# EAGLE schematic SGWB circuit test board rev1 (EAGLE 9.5.0)
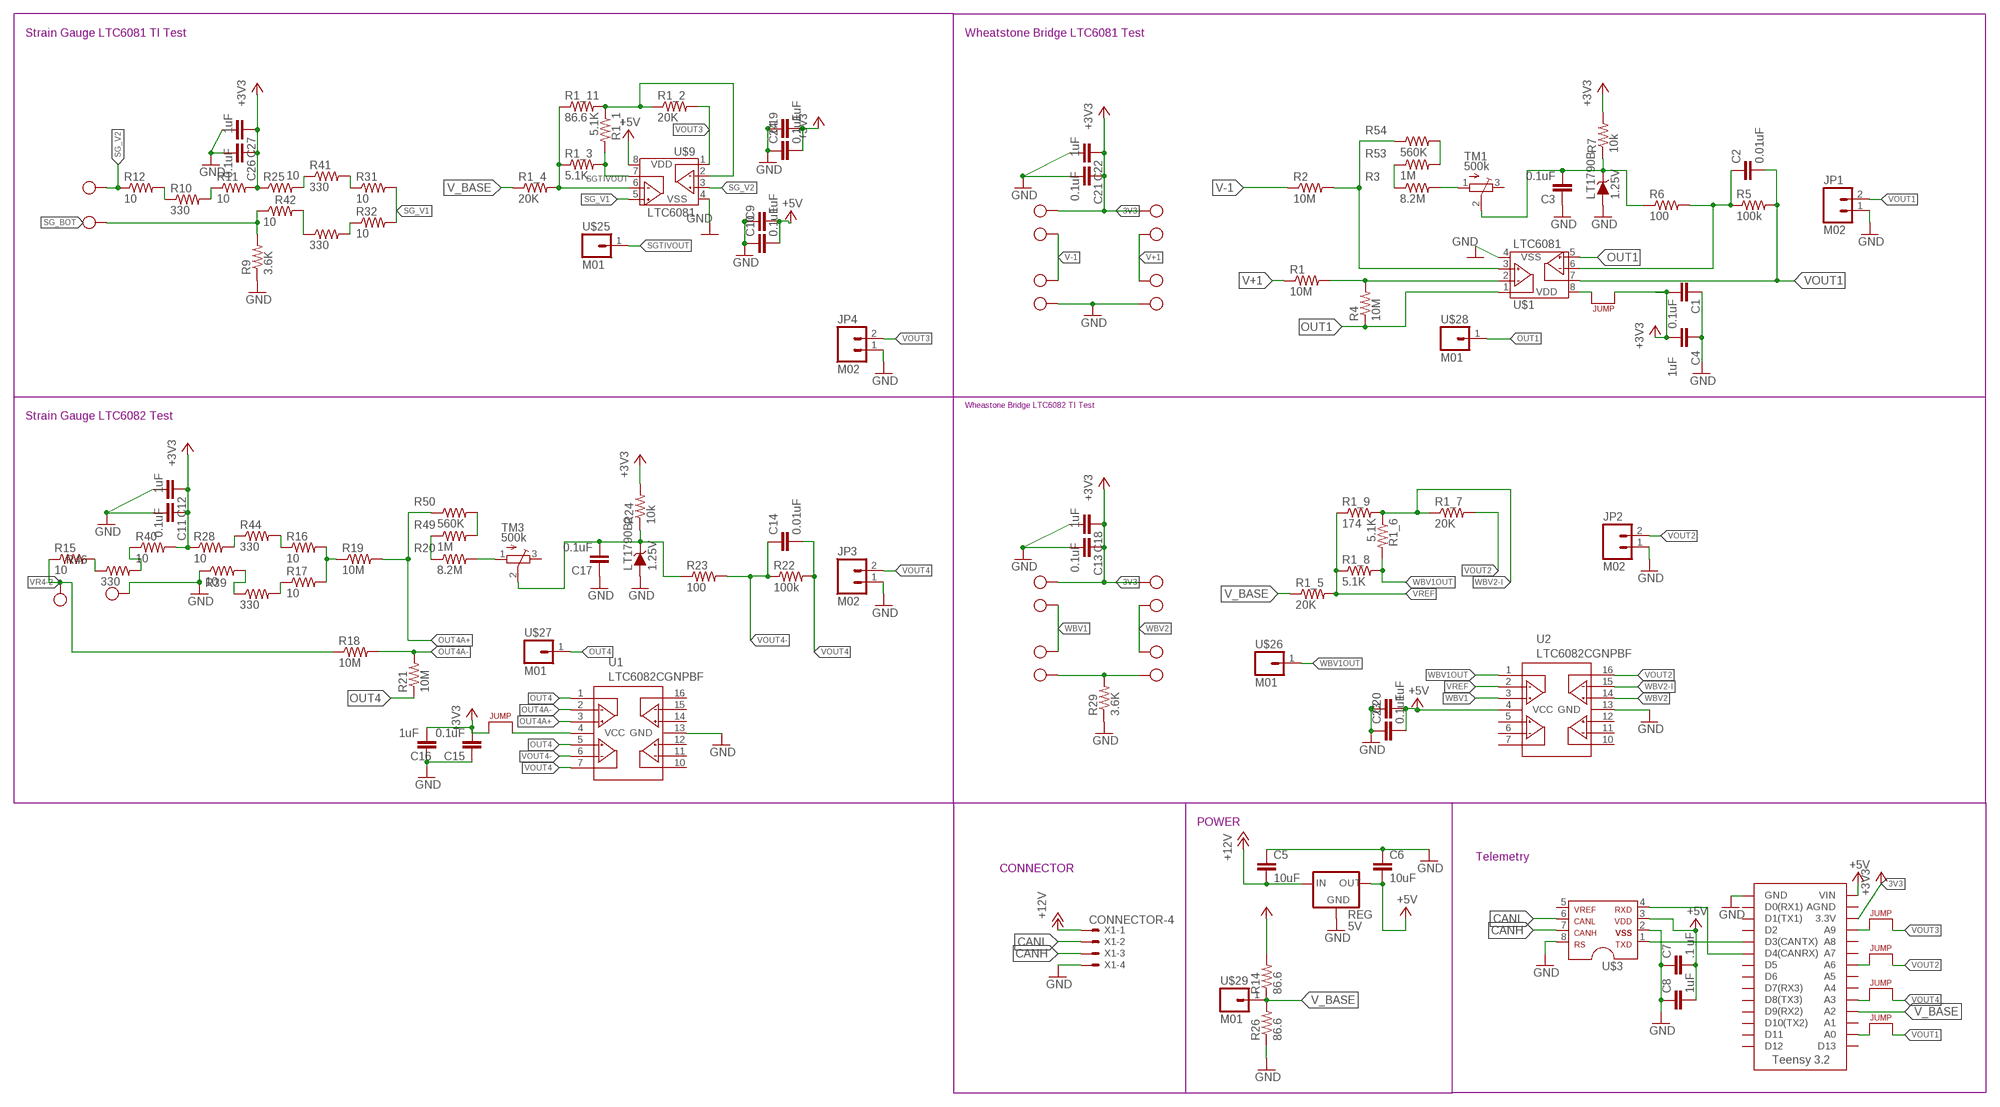
[diagram p0: schematic, sheet 1]

## Parts
C1  0.1uF  CAP0805  [0805]
C2  0.01uF  CAPPTH  [CAP-PTH-SMALL]
C3  0.1uF  CAPPTH  [CAP-PTH-SMALL]
C4  1uF  CAPPTH  [CAP-PTH-SMALL]
C5  10uF  CAPPTH  [CAP-PTH-SMALL]
C6  10uF  CAPPTH  [CAP-PTH-SMALL]
C7  .1 uF  CAP0805  [0805]
C8  1uF  CAP0805  [0805]
C9  1uF  CAP0805  [0805]
C10  0.1uF  CAPPTH  [CAP-PTH-SMALL]
C11  0.1uF  CAPPTH  [CAP-PTH-SMALL]
C12  1uF  CAP0805  [0805]
C13  0.1uF  CAPPTH  [CAP-PTH-SMALL]
C14  0.01uF  CAPPTH  [CAP-PTH-SMALL]
C15  0.1uF  CAPPTH  [CAP-PTH-SMALL]
C16  1uF  CAP0805  [0805]
C17  0.1uF  CAPPTH  [CAP-PTH-SMALL]
C18  1uF  CAP0805  [0805]
C19  1uF  CAP0805  [0805]
C20  1uF  CAP0805  [0805]
C21  0.1uF  CAPPTH  [CAP-PTH-SMALL]
C22  1uF  CAP0805  [0805]
C23  0.1uF  CAPPTH  [CAP-PTH-SMALL]
C24  0.1uF  CAPPTH  [CAP-PTH-SMALL]
C26  0.1uF  CAPPTH  [CAP-PTH-SMALL]
C27  1uF  CAP0805  [0805]
J1  JUMPER.1  [1X02]
J2  JUMPER.1  [1X02]
J3  JUMPER.1  [1X02]
J4  JUMPER.1  [1X02]
J5  JUMPER.1  [1X02]
J6  JUMPER.1  [1X02]
JP1  M02  [1X02]
JP2  M02  [1X02]
JP3  M02  [1X02]
JP4  M02  [1X02]
LT1790B  1.25V  DIODE_ZENER0805  [0805_D]
LT1790B2  1.25V  DIODE_ZENER0805  [0805_D]
R1  10M  RESISTORAXIAL-0.3  [AXIAL-0.3]
R1_1  5.1K  RESISTORAXIAL-0.3  [AXIAL-0.3]
R1_2  20K  RESISTORAXIAL-0.3  [AXIAL-0.3]
R1_3  5.1K  RESISTORAXIAL-0.3  [AXIAL-0.3]
R1_4  20K  RESISTORAXIAL-0.3  [AXIAL-0.3]
R1_5  20K  RESISTORAXIAL-0.3  [AXIAL-0.3]
R1_6  5.1K  RESISTORAXIAL-0.3  [AXIAL-0.3]
R1_7  20K  RESISTORAXIAL-0.3  [AXIAL-0.3]
R1_8  5.1K  RESISTORAXIAL-0.3  [AXIAL-0.3]
R1_9  174  RESISTORAXIAL-0.3  [AXIAL-0.3]
R1_11  86.6  RESISTORAXIAL-0.3  [AXIAL-0.3]
R2  10M  RESISTORAXIAL-0.3  [AXIAL-0.3]
R3  8.2M  RESISTORAXIAL-0.3  [AXIAL-0.3]
R4  10M  RESISTORAXIAL-0.3  [AXIAL-0.3]
R5  100k  RESISTORAXIAL-0.3  [AXIAL-0.3]
R6  100  RESISTORAXIAL-0.3  [AXIAL-0.3]
R7  10k  RESISTORAXIAL-0.3  [AXIAL-0.3]
R9  3.6K  RESISTORAXIAL-0.3  [AXIAL-0.3]
R10  330  RESISTORAXIAL-0.3  [AXIAL-0.3]
R11  10  RESISTORAXIAL-0.3  [AXIAL-0.3]
R12  10  RESISTORAXIAL-0.3  [AXIAL-0.3]
R14  86.6  RESISTORAXIAL-0.3  [AXIAL-0.3]
R15  10  RESISTORAXIAL-0.3  [AXIAL-0.3]
R16  10  RESISTORAXIAL-0.3  [AXIAL-0.3]
R17  10  RESISTORAXIAL-0.3  [AXIAL-0.3]
R18  10M  RESISTORAXIAL-0.3  [AXIAL-0.3]
R19  10M  RESISTORAXIAL-0.3  [AXIAL-0.3]
R20  8.2M  RESISTORAXIAL-0.3  [AXIAL-0.3]
R21  10M  RESISTORAXIAL-0.3  [AXIAL-0.3]
R22  100k  RESISTORAXIAL-0.3  [AXIAL-0.3]
R23  100  RESISTORAXIAL-0.3  [AXIAL-0.3]
R24  10k  RESISTORAXIAL-0.3  [AXIAL-0.3]
R25  10  RESISTORAXIAL-0.3  [AXIAL-0.3]
R26  86.6  RESISTORAXIAL-0.3  [AXIAL-0.3]
R27  330  RESISTORAXIAL-0.3  [AXIAL-0.3]
R28  10  RESISTORAXIAL-0.3  [AXIAL-0.3]
R29  3.6K  RESISTORAXIAL-0.3  [AXIAL-0.3]
R31  10  RESISTORAXIAL-0.3  [AXIAL-0.3]
R32  10  RESISTORAXIAL-0.3  [AXIAL-0.3]
R39  330  RESISTORAXIAL-0.3  [AXIAL-0.3]
R40  10  RESISTORAXIAL-0.3  [AXIAL-0.3]
R41  330  RESISTORAXIAL-0.3  [AXIAL-0.3]
R42  10  RESISTORAXIAL-0.3  [AXIAL-0.3]
R44  330  RESISTORAXIAL-0.3  [AXIAL-0.3]
R45  10  RESISTORAXIAL-0.3  [AXIAL-0.3]
R46  330  RESISTORAXIAL-0.3  [AXIAL-0.3]
R49  1M  RESISTORAXIAL-0.3  [AXIAL-0.3]
R50  560K  RESISTORAXIAL-0.3  [AXIAL-0.3]
R53  1M  RESISTORAXIAL-0.3  [AXIAL-0.3]
R54  560K  RESISTORAXIAL-0.3  [AXIAL-0.3]
REG  5V  OKI-78SR-5  [OKI-78SR]
TM1  500k  TRIMPOT3386  [TRIM-3386]
TM3  500k  TRIMPOT3386  [TRIM-3386]
U1  LTC6082CGNPBF  [SSOP-16_GN]
U2  LTC6082CGNPBF  [SSOP-16_GN]
U$1  LTC6081  [MSOP-8_MS]
U$2  TEENSY_3.2_SIMPLE  [TEENSY_3.2_SIMPLE]
U$3  MCP2551DIL  [DIL08]
U$4  TEST_POINT  [TEST_POINT]
U$5  TEST_POINT  [TEST_POINT]
U$6  TEST_POINT  [TEST_POINT]
U$7  TEST_POINT  [TEST_POINT]
U$8  TEST_POINT  [TEST_POINT]
U$9  LTC6081  [MSOP-8_MS]
U$10  TEST_POINT  [TEST_POINT]
U$11  TEST_POINT  [TEST_POINT]
U$12  TEST_POINT  [TEST_POINT]
U$13  TEST_POINT  [TEST_POINT]
U$14  TEST_POINT  [TEST_POINT]
U$15  TEST_POINT  [TEST_POINT]
U$16  TEST_POINT  [TEST_POINT]
U$17  TEST_POINT  [TEST_POINT]
U$18  TEST_POINT  [TEST_POINT]
U$19  TEST_POINT  [TEST_POINT]
U$20  TEST_POINT  [TEST_POINT]
U$21  TEST_POINT  [TEST_POINT]
U$22  TEST_POINT  [TEST_POINT]
U$23  TEST_POINT  [TEST_POINT]
U$24  TEST_POINT  [TEST_POINT]
U$25  M01  [1X01]
U$26  M01  [1X01]
U$27  M01  [1X01]
U$28  M01  [1X01]
U$29  M01  [1X01]
X1  CONNECTOR-4  [MINIFIT_5566-4]

## Nets
3V3: C1.2 C4.1 C11.1 C12.1 C13.1 C15.2 C16.1 C18.1 C19.1 C21.1 C22.1 C24.2 C26.1 C27.1 J5.1 J6.1 R7.P$2 R11.P$2 R14.P$2 R24.P$2 R25.P$1 R28.P$1 R40.P$2 U$2.3.3V U$4.P$1 U$11.P$1 U$18.P$1 U$24.P$1 ; supply symbol labelled +3V3
+5V: C6.2 C7.2 C8.2 C9.1 C10.2 C20.1 C23.2 REG.3(OUT) U2.4(VCC) U$2.VIN U$3.3 U$9.8(VDD)
+12V: C5.2 REG.1(IN) X1.1
CANH: U$3.7 X1.3
CANL: U$3.6 X1.2
GND: C1.1 C3.1 C4.2 C5.1 C6.1 C7.1 C8.1 C9.2 C10.1 C11.2 C12.2 C13.2 C15.1 C16.2 C17.1 C18.2 C19.2 C20.2 C21.2 C22.2 C23.1 C24.1 C26.2 C27.2 JP1.1 JP2.1 JP3.1 JP4.1 LT1790B2.A LT1790B.A R9.P$1 R26.P$1 R29.P$1 R45.P$1 REG.2(GND) U1.13(GND) U2.13(GND) U$1.4(VSS) U$2.GND U$3.2 U$3.8 U$8.P$1 U$9.4(VSS) U$14.P$1 U$15.P$1 X1.4
INB-: C2.1 R5.P$1 R6.P$2 U$1.6(VINB-)
N$1: R1.P$2 R4.P$2 U$1.2(VINA-)
N$2: R2.P$2 R54.P$1 U$1.3(VINA+)
N$3: C3.2 LT1790B.C R6.P$1 R7.P$1 TM1.2(S)
N$4: J1.1 U$2.A0
N$5: R3.P$2 TM1.1(A)
N$6: U$2.D3(CANTX) U$3.1
N$7: J2.1 U$2.A3
N$8: J3.1 U$2.A6
N$9: U$2.D4(CANRX) U$3.4
N$10: R1_3.P$1 R1_4.P$2 R1_11.P$1 U$9.6(VINB-)
N$11: R10.P$1 R12.P$2
N$12: R10.P$2 R11.P$1
N$13: R16.P$2 R17.P$2 R19.P$1
N$14: J5.2 U1.4(VCC)
N$15: J6.2 U$1.8(VDD)
N$16: C17.2 LT1790B2.C R23.P$1 R24.P$1 TM3.2(S)
N$17: R20.P$2 TM3.1(A)
N$18: R1_1.P$1 R1_2.P$1 R1_11.P$2 U$9.2(VINA-)
N$19: R27.P$2 R32.P$1
N$20: R31.P$1 R41.P$2
N$21: R16.P$1 R44.P$2
N$22: J4.1 U$2.A9
N$23: R29.P$2 U$20.P$1 U$21.P$1
N$24: R17.P$1 R39.P$2
N$25: R25.P$2 R41.P$1
N$31: R27.P$1 R42.P$2
N$33: R28.P$2 R44.P$1
N$34: R39.P$1 R45.P$2
N$35: R15.P$2 R46.P$1
N$36: R40.P$1 R46.P$2
N$41: R20.P$1 R49.P$1
N$42: R49.P$2 R50.P$2
N$49: R3.P$1 R53.P$1
N$50: R53.P$2 R54.P$2
OUT1: R4.P$1 U$1.1(VOUTA) U$1.5(VINB+) U$28.1
OUT4: R21.P$1 U1.1(OUTA) U1.5(+INB) U$27.1
OUT4A+: R19.P$2 R50.P$1 U1.3(+INA)
OUT4A-: R18.P$2 R21.P$2 U1.2(-INA)
SG_BOT: R9.P$2 R42.P$1 U$6.P$1
SG_V1: R31.P$2 R32.P$2 U$9.5(VINB+)
SG_V2: R12.P$1 U$5.P$1 U$9.3(VINA+)
SGTIVOUT: R1_1.P$2 R1_3.P$2 U$9.7(VOUTB) U$25.1
V+1: R1.P$1 U$12.P$1 U$13.P$1
V-1: R2.P$1 U$16.P$1 U$17.P$1
V_BASE: R1_4.P$1 R1_5.P$1 R14.P$1 R26.P$2 U$2.A2 U$29.1
VOUT1: C2.2 J1.2 JP1.2 R5.P$2 U$1.7(VOUTB)
VOUT2: J3.2 JP2.2 R1_7.P$2 U2.16(OUTD)
VOUT3: J4.2 JP4.2 R1_2.P$2 U$9.1(VOUTA)
VOUT4: C14.2 J2.2 JP3.2 R22.P$2 U1.7(OUTB)
VOUT4-: C14.1 R22.P$1 R23.P$2 U1.6(-INB)
VR4-2: R15.P$1 R18.P$1 U$10.P$1
VREF: R1_5.P$2 R1_8.P$1 R1_9.P$1 U2.2(-INA)
WBV1: U2.3(+INA) U$22.P$1 U$23.P$1
WBV1OUT: R1_6.P$2 R1_8.P$2 U2.1(OUTA) U$26.1
WBV2: U2.14(+IND) U$7.P$1 U$19.P$1
WBV2-I: R1_6.P$1 R1_7.P$1 R1_9.P$2 U2.15(-IND)
Unconnected: TM1.3(E) TM3.3(E) U1.10(OUTC) U1.11(-INC) U1.12(+INC) U1.14(+IND) U1.15(-IND) U1.16(OUTD) U2.5(+INB) U2.6(-INB) U2.7(OUTB) U2.10(OUTC) U2.11(-INC) U2.12(+INC) U$2.A1 U$2.A4 U$2.A5 U$2.A7 U$2.A8 U$2.AGND U$2.D0(RX1) U$2.D1(TX1) U$2.D2 U$2.D5 U$2.D6 U$2.D7(RX3) U$2.D8(TX3) U$2.D9(RX2) U$2.D10(TX2) U$2.D11 U$2.D12 U$2.D13 U$3.5

## Notes on the sheet
- Strain Gauge LTC6081 TI Test | Wheatstone Bridge LTC6081 Test
- Wheastone Bridge LTC6082 TI Test
- Strain Gauge LTC6082 Test
- POWER
- Telemetry
- CONNECTOR

## Library data of the parts
C1-C24 C26 C27 = HyTechDevices:CAP: Capacitor Standard 0603 ceramic capacitor, and 0.1" leaded capacitor.
J1-J6 = HyTechDevices:JUMPER: Jumper for changing operation of a device
JP1-JP4 = HyTechDevices:M02: Standard 2-pin 0.1" header. NOTES ON THE VARIANTS LOCK and LOCK_LONGPADS... This footprint was designed to help hold the alignment of a through-hole component (i.e. 6-pin header) while soldering it into place. You may notice that each hole has been shifted either up or down by 0.005 of an inch from it's more standard position (which is a perfectly straight line). This slight alteration caused the pins (the squares in the middle) to touch the edges of the holes. Because they are alternating, it causes a "brace" to hold the component in place. 0.005 has proven to be the perfect amount of "off-center" position when using our standard breakaway headers. Although looks a little odd when you look at the bare footprint, once you have a header in there, the alteration is very hard to notice. Also,if you push a header all the way into place, it is covered up entirely on the bottom side. This idea of altering the position of holes to aid alignment will be further integrated into the Sparkfun Library for other footprints. It can help hold any component with 3 or more connection pins. Note: The Sparkfun version includes many other packages including surface mount that may be of future interest. Source: Sparkfun <https://github.com/sparkfun/SparkFun-Eagle-Libraries>
LT1790B LT1790B2 = HyTechDevices:DIODE_ZENER: ZENER DIODE
R1 R1_1-R1_9 R1_11 R2-R7 R9-R12 R14-R29 R31 R32 R39-R42 R44-R46 R49 R50 R53 R54 = HyTechDevices:RESISTOR: Resistor Basic schematic elements and footprints for 0603, 1206, and PTH resistors.
REG = HyTechDevices:OKI-78SR-5: Murata OKI-78SR 5V 1.5A Non-Isolated Switching Regulator DC/DC - Datasheet <https://power.murata.com/data/power/oki-78sr.pdf>
TM1 TM3 = HyTechDevices:TRIMPOT: SMT trimmer potentiometer part number TC33X http://www.ladyada.net/library/eagle
U1 U2 = HyTechDevices:LTC6082CGNPBF; MANUFACTURER_PART_NUMBER: LTC6082CGN#PBF; VENDOR: Linear Technology
U$1 U$9 = HyTechDevices:LTC6081
U$2 = HyTechDevices:TEENSY_3.2_SIMPLE: Simple version of the Teensy 3.2 board that only uses the 2 main rows of pins, with no perpendicular row with VBat or inner pins.
U$3 = HyTechDevices:MCP2551: MCP2551 High-Speed CAN Transceiver Product Webpage <https://www.microchip.com/wwwproducts/en/MCP2551> Datasheet <http://ww1.microchip.com/downloads/en/DeviceDoc/21667f.pdf> This device is outdated It is replaced by MCP2561. Comparison Page <https://www.microchip.com/wwwproducts/ProductCompare/MCP2551/MCP2561> Product Webpage <https://www.microchip.com/wwwproducts/en/MCP2561> Datasheet <http://ww1.microchip.com/downloads/en/DeviceDoc/20005167C.pdf>
U$4-U$8 U$10-U$24 = HyTechDevices:TEST_POINT: Keystone Electronics Test Point 5005
U$25-U$29 = HyTechDevices:M01: Standard 1-pin header
X1 = HyTechDevices:CONNECTOR-4: Mini-Fit Junior connector 4 pole Source: http://www.molex.com; OC_FARNELL: unknown; OC_NEWARK: unknown